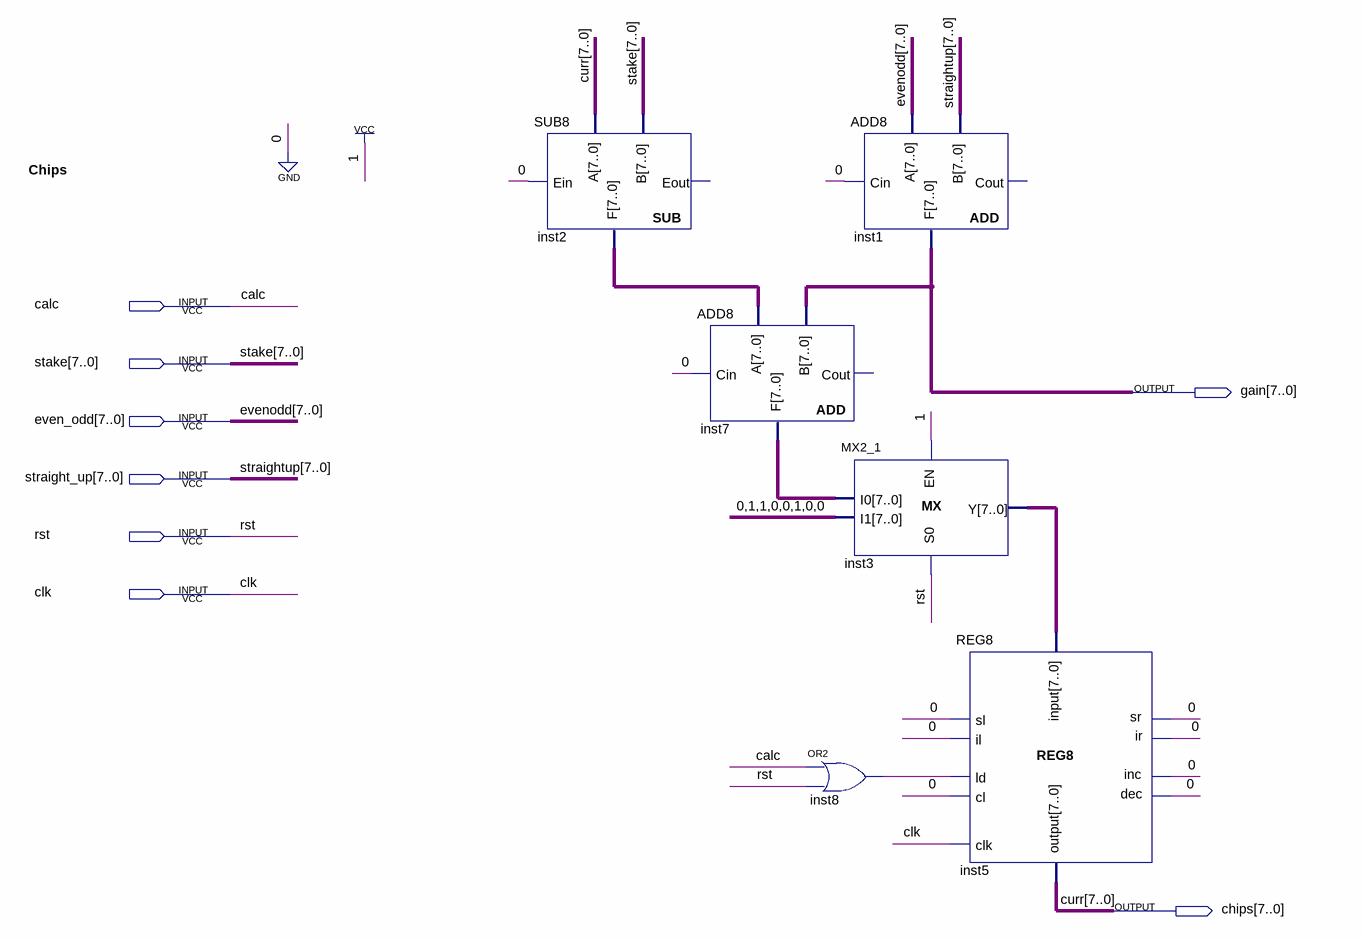
[diagram p0: schematic sheet]
// Quartus schematic Chips.bdf as structural Verilog: 6 symbols, 8 pins
module Chips (
  input  calc,
  input  [7:0] stake,
  input  [7:0] even_odd,
  input  [7:0] straight_up,
  input  rst,
  input  clk,
  output [7:0] gain,
  output [7:0] chips
);

  wire inst8_out;
  wire [7:0] inst2_f, inst3_y, inst7_f;

  SUB8 inst2 (.A(chips), .B(stake), .Ein(1'b0), .F(inst2_f));  // open: Eout
  ADD8 inst7 (.A(inst2_f), .B(gain), .Cin(1'b0), .F(inst7_f));  // open: Cout
  ADD8 inst1 (.A(even_odd), .B(straight_up), .Cin(1'b0), .F(gain));  // open: Cout
  MX2_1 inst3 (.I1(8'b01100100), .I0(inst7_f), .S0(rst), .EN(1'b1), .Y(inst3_y));
  or inst8 (inst8_out, calc, rst);
  REG8 inst5 (
    .clk(clk), .ld(inst8_out), .\input (inst3_y), .sr(1'b0), .ir(1'b0), .sl(1'b0), .il(1'b0), .inc(1'b0),
    .dec(1'b0), .cl(1'b0), .\output (chips));

  // Other names for the same wires on the sheet: curr[7:0] = chips; evenodd[7:0] = even_odd;
  //   straightup[7:0] = straight_up

  // Notes on the sheet:
  //   Chips
endmodule
